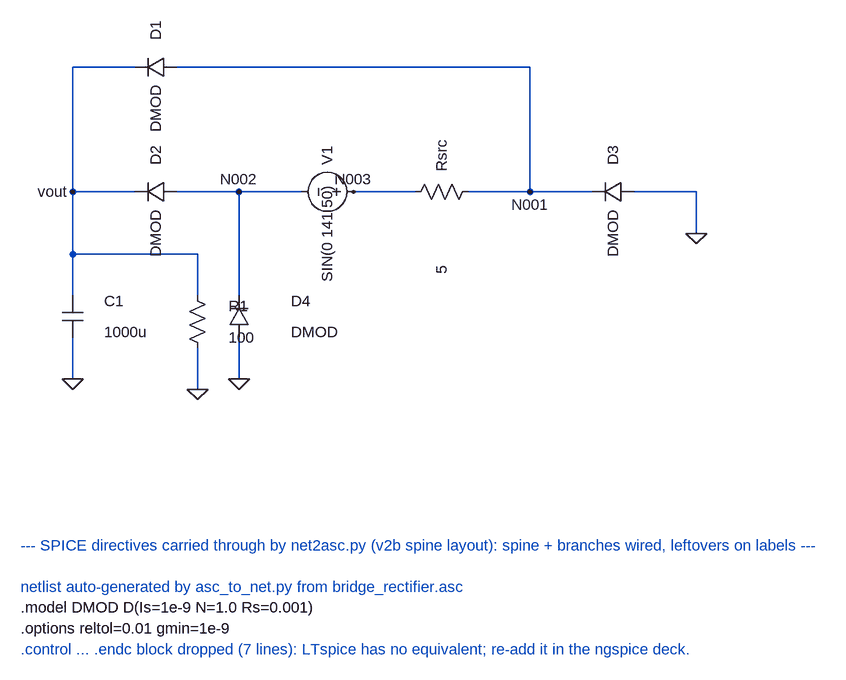
[diagram p0: schematic bridge_rectifier.asc]
bridge_rectifier.asc, the LTspice schematic file:
Version 4
SHEET 1 2080 1232
WIRE 144 336 240 336
WIRE 304 336 400 336
WIRE 400 336 496 336
WIRE 576 336 672 336
WIRE 752 336 848 336
WIRE 848 336 944 336
WIRE 1008 336 1104 336
WIRE 1104 336 1104 400
WIRE 144 336 144 144
WIRE 144 144 240 144
WIRE 304 144 848 144
WIRE 848 144 848 336
WIRE 144 336 144 432
WIRE 144 432 144 496
WIRE 144 560 144 624
WIRE 144 336 144 432
WIRE 144 432 336 432
WIRE 336 432 336 496
WIRE 336 576 336 640
WIRE 400 336 400 432
WIRE 400 432 400 496
WIRE 400 560 400 624
FLAG 144 336 vout
FLAG 400 336 N002
FLAG 848 336 N001
FLAG 1104 400 0
FLAG 144 624 0
FLAG 336 640 0
FLAG 400 624 0
FLAG 576 336 N003
SYMBOL diode 304 320 R90
WINDOW 0 -40 32 Center 2
WINDOW 3 80 32 Center 2
SYMATTR InstName D2
SYMATTR Value DMOD
SYMBOL voltage 592 336 R90
WINDOW 0 -56 56 Center 2
WINDOW 3 64 56 Center 2
SYMATTR InstName V1
SYMATTR Value SIN(0 141 50)
SYMBOL res 656 352 R270
WINDOW 0 72 56 Center 2
WINDOW 3 -104 56 Center 2
SYMATTR InstName Rsrc
SYMATTR Value 5
SYMBOL diode 1008 320 R90
WINDOW 0 -40 32 Center 2
WINDOW 3 80 32 Center 2
SYMATTR InstName D3
SYMATTR Value DMOD
SYMBOL diode 304 128 R90
WINDOW 0 -40 32 Center 2
WINDOW 3 80 32 Center 2
SYMATTR InstName D1
SYMATTR Value DMOD
SYMBOL cap 128 496 R0
WINDOW 0 64 8 Left 2
WINDOW 3 64 56 Left 2
SYMATTR InstName C1
SYMATTR Value 1000u
SYMBOL res 320 480 R0
WINDOW 0 64 32 Left 2
WINDOW 3 64 80 Left 2
SYMATTR InstName R1
SYMATTR Value 100
SYMBOL diode 416 560 R180
WINDOW 0 -64 56 Right 2
WINDOW 3 -64 8 Right 2
SYMATTR InstName D4
SYMATTR Value DMOD
TEXT 64 880 Left 2 ;--- SPICE directives carried through by net2asc.py (v2b spine layout): spine + branches wired, leftovers on labels ---
TEXT 64 944 Left 2 ;netlist auto-generated by asc_to_net.py from bridge_rectifier.asc
TEXT 64 976 Left 2 !.model DMOD D(Is=1e-9 N=1.0 Rs=0.001)
TEXT 64 1008 Left 2 !.options reltol=0.01 gmin=1e-9
TEXT 64 1040 Left 2 ;.control ... .endc block dropped (7 lines): LTspice has no equivalent; re-add it in the ngspice deck.

The netlist it stands for:
* bridge_rectifier.asc
D2 N002 vout DMOD
V1 N003 N002 SIN(0 141 50)
Rsrc N003 N001 5
D3 0 N001 DMOD
D1 N001 vout DMOD
C1 vout 0 1000u
R1 vout 0 100
D4 0 N002 DMOD
.model D D
.lib standard.dio
* --- SPICE directives carried through by net2asc.py (v2b spine layout): spine + branches wired, leftovers on labels ---
* netlist auto-generated by asc_to_net.py from bridge_rectifier.asc
.model DMOD D(Is=1e-9 N=1.0 Rs=0.001)
.options reltol=0.01 gmin=1e-9
* .control ... .endc block dropped (7 lines): LTspice has no equivalent; re-add it in the ngspice deck.
.backanno
.end